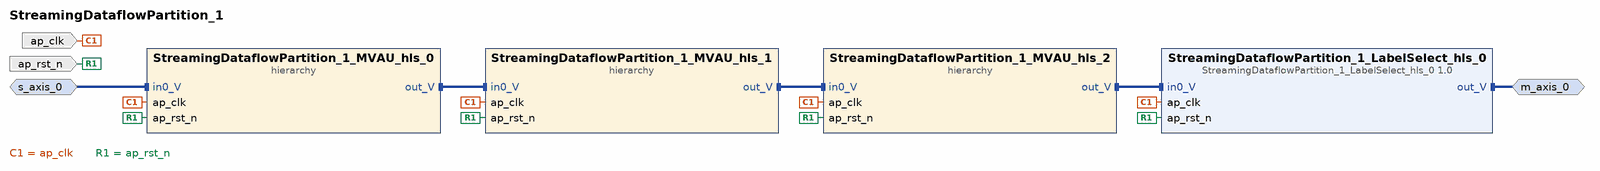
[diagram p0: block diagram of the top level]
# Vivado block design StreamingDataflowPartition_1, xc7z020clg400-1, Vivado 2024.2
create_bd_design StreamingDataflowPartition_1

create_bd_intf_port -mode Slave -vlnv xilinx.com:interface:axis_rtl:1.0 s_axis_0
set_property -dict [list \
  CONFIG.FREQ_HZ 50000000 \
  CONFIG.HAS_TKEEP 0 \
  CONFIG.HAS_TLAST 0 \
  CONFIG.HAS_TREADY 1 \
  CONFIG.HAS_TSTRB 0 \
  CONFIG.LAYERED_METADATA undef \
  CONFIG.TDATA_NUM_BYTES 1 \
  CONFIG.TDEST_WIDTH 0 \
  CONFIG.TID_WIDTH 0 \
  CONFIG.TUSER_WIDTH 0 \
] [get_bd_intf_ports s_axis_0]
create_bd_intf_port -mode Master -vlnv xilinx.com:interface:axis_rtl:1.0 m_axis_0
set_property -dict {CONFIG.FREQ_HZ 50000000} [get_bd_intf_ports m_axis_0]
create_bd_port -dir I -type clk ap_clk
set_property -dict {CONFIG.FREQ_HZ 50000000 CONFIG.FREQ_TOLERANCE_HZ -1} [get_bd_ports ap_clk]
create_bd_port -dir I -type rst ap_rst_n

create_bd_cell -type hier StreamingDataflowPartition_1_MVAU_hls_0
create_bd_cell -type hier StreamingDataflowPartition_1_MVAU_hls_1
create_bd_cell -type hier StreamingDataflowPartition_1_MVAU_hls_2
create_bd_cell -type ip -vlnv xilinx.com:hls:StreamingDataflowPartition_1_LabelSelect_hls_0:1.0 StreamingDataflowPartition_1_LabelSelect_hls_0

# ---- hierarchy /StreamingDataflowPartition_1_MVAU_hls_0 ----
current_bd_instance /StreamingDataflowPartition_1_MVAU_hls_0
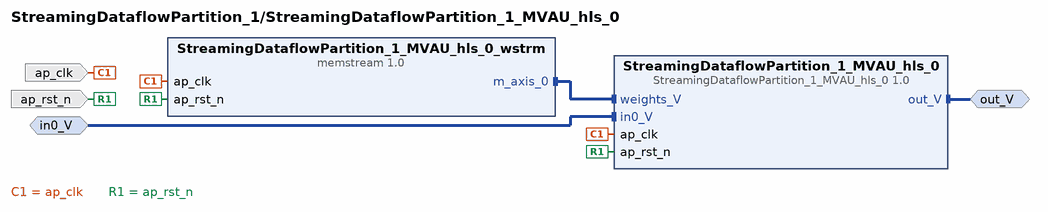
[diagram p1: block diagram inside /StreamingDataflowPartition_1_MVAU_hls_0]
create_bd_intf_pin -mode Master -vlnv xilinx.com:interface:axis_rtl:1.0 out_V
create_bd_intf_pin -mode Slave -vlnv xilinx.com:interface:axis_rtl:1.0 in0_V
create_bd_pin -dir I -type clk ap_clk
create_bd_pin -dir I -type rst ap_rst_n

create_bd_cell -type ip -vlnv xilinx.com:hls:StreamingDataflowPartition_1_MVAU_hls_0:1.0 StreamingDataflowPartition_1_MVAU_hls_0
create_bd_cell -type ip -vlnv amd.com:finn:memstream:1.0 StreamingDataflowPartition_1_MVAU_hls_0_wstrm
set_property -dict [list \
  CONFIG.DEPTH 50176 \
  CONFIG.INIT_FILE /tmp/finn_dev_emre/code_gen_ipgen_StreamingDataflowPartition_1_MVAU_hls_0_vpjpp7ae/memblock.dat \
  CONFIG.RAM_STYLE auto \
  CONFIG.WIDTH 8 \
] [get_bd_cells StreamingDataflowPartition_1_MVAU_hls_0_wstrm]

# ---- hierarchy /StreamingDataflowPartition_1_MVAU_hls_1 ----
current_bd_instance /StreamingDataflowPartition_1_MVAU_hls_1
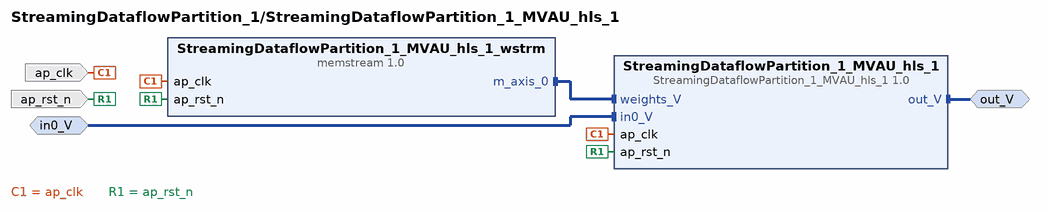
[diagram p2: block diagram inside /StreamingDataflowPartition_1_MVAU_hls_1]
create_bd_intf_pin -mode Master -vlnv xilinx.com:interface:axis_rtl:1.0 out_V
create_bd_intf_pin -mode Slave -vlnv xilinx.com:interface:axis_rtl:1.0 in0_V
create_bd_pin -dir I -type clk ap_clk
create_bd_pin -dir I -type rst ap_rst_n

create_bd_cell -type ip -vlnv xilinx.com:hls:StreamingDataflowPartition_1_MVAU_hls_1:1.0 StreamingDataflowPartition_1_MVAU_hls_1
create_bd_cell -type ip -vlnv amd.com:finn:memstream:1.0 StreamingDataflowPartition_1_MVAU_hls_1_wstrm
set_property -dict [list \
  CONFIG.DEPTH 4096 \
  CONFIG.INIT_FILE /tmp/finn_dev_emre/code_gen_ipgen_StreamingDataflowPartition_1_MVAU_hls_1_2hlhfuts/memblock.dat \
  CONFIG.RAM_STYLE auto \
  CONFIG.WIDTH 8 \
] [get_bd_cells StreamingDataflowPartition_1_MVAU_hls_1_wstrm]

# ---- hierarchy /StreamingDataflowPartition_1_MVAU_hls_2 ----
current_bd_instance /StreamingDataflowPartition_1_MVAU_hls_2
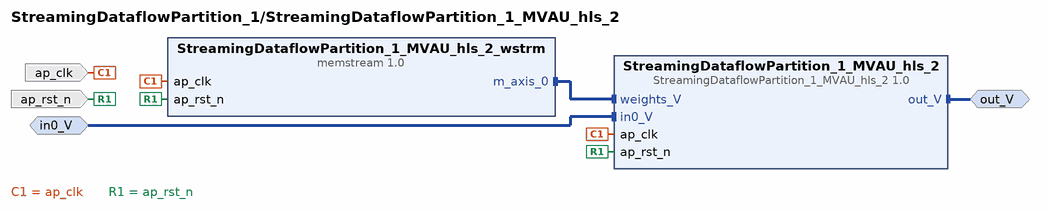
[diagram p3: block diagram inside /StreamingDataflowPartition_1_MVAU_hls_2]
create_bd_intf_pin -mode Master -vlnv xilinx.com:interface:axis_rtl:1.0 out_V
create_bd_intf_pin -mode Slave -vlnv xilinx.com:interface:axis_rtl:1.0 in0_V
create_bd_pin -dir I -type clk ap_clk
create_bd_pin -dir I -type rst ap_rst_n

create_bd_cell -type ip -vlnv xilinx.com:hls:StreamingDataflowPartition_1_MVAU_hls_2:1.0 StreamingDataflowPartition_1_MVAU_hls_2
create_bd_cell -type ip -vlnv amd.com:finn:memstream:1.0 StreamingDataflowPartition_1_MVAU_hls_2_wstrm
set_property -dict [list \
  CONFIG.DEPTH 640 \
  CONFIG.INIT_FILE /tmp/finn_dev_emre/code_gen_ipgen_StreamingDataflowPartition_1_MVAU_hls_2_738qp6bw/memblock.dat \
  CONFIG.RAM_STYLE auto \
  CONFIG.WIDTH 8 \
] [get_bd_cells StreamingDataflowPartition_1_MVAU_hls_2_wstrm]

# ---- connections ----

current_bd_instance /StreamingDataflowPartition_1_MVAU_hls_0
connect_bd_intf_net [get_bd_intf_pins out_V] [get_bd_intf_pins StreamingDataflowPartition_1_MVAU_hls_0/out_V]
connect_bd_intf_net [get_bd_intf_pins StreamingDataflowPartition_1_MVAU_hls_0_wstrm/m_axis_0] [get_bd_intf_pins StreamingDataflowPartition_1_MVAU_hls_0/weights_V]
connect_bd_intf_net [get_bd_intf_pins in0_V] [get_bd_intf_pins StreamingDataflowPartition_1_MVAU_hls_0/in0_V]
connect_bd_net [get_bd_pins ap_clk] \
  [get_bd_pins StreamingDataflowPartition_1_MVAU_hls_0_wstrm/ap_clk] \
  [get_bd_pins StreamingDataflowPartition_1_MVAU_hls_0/ap_clk]
connect_bd_net [get_bd_pins ap_rst_n] \
  [get_bd_pins StreamingDataflowPartition_1_MVAU_hls_0_wstrm/ap_rst_n] \
  [get_bd_pins StreamingDataflowPartition_1_MVAU_hls_0/ap_rst_n]

current_bd_instance /StreamingDataflowPartition_1_MVAU_hls_1
connect_bd_intf_net [get_bd_intf_pins out_V] [get_bd_intf_pins StreamingDataflowPartition_1_MVAU_hls_1/out_V]
connect_bd_intf_net [get_bd_intf_pins StreamingDataflowPartition_1_MVAU_hls_1_wstrm/m_axis_0] [get_bd_intf_pins StreamingDataflowPartition_1_MVAU_hls_1/weights_V]
connect_bd_intf_net [get_bd_intf_pins in0_V] [get_bd_intf_pins StreamingDataflowPartition_1_MVAU_hls_1/in0_V]
connect_bd_net [get_bd_pins ap_clk] \
  [get_bd_pins StreamingDataflowPartition_1_MVAU_hls_1_wstrm/ap_clk] \
  [get_bd_pins StreamingDataflowPartition_1_MVAU_hls_1/ap_clk]
connect_bd_net [get_bd_pins ap_rst_n] \
  [get_bd_pins StreamingDataflowPartition_1_MVAU_hls_1_wstrm/ap_rst_n] \
  [get_bd_pins StreamingDataflowPartition_1_MVAU_hls_1/ap_rst_n]

current_bd_instance /StreamingDataflowPartition_1_MVAU_hls_2
connect_bd_intf_net [get_bd_intf_pins out_V] [get_bd_intf_pins StreamingDataflowPartition_1_MVAU_hls_2/out_V]
connect_bd_intf_net [get_bd_intf_pins StreamingDataflowPartition_1_MVAU_hls_2_wstrm/m_axis_0] [get_bd_intf_pins StreamingDataflowPartition_1_MVAU_hls_2/weights_V]
connect_bd_intf_net [get_bd_intf_pins in0_V] [get_bd_intf_pins StreamingDataflowPartition_1_MVAU_hls_2/in0_V]
connect_bd_net [get_bd_pins ap_clk] \
  [get_bd_pins StreamingDataflowPartition_1_MVAU_hls_2_wstrm/ap_clk] \
  [get_bd_pins StreamingDataflowPartition_1_MVAU_hls_2/ap_clk]
connect_bd_net [get_bd_pins ap_rst_n] \
  [get_bd_pins StreamingDataflowPartition_1_MVAU_hls_2_wstrm/ap_rst_n] \
  [get_bd_pins StreamingDataflowPartition_1_MVAU_hls_2/ap_rst_n]

current_bd_instance /
connect_bd_intf_net [get_bd_intf_ports m_axis_0] [get_bd_intf_pins StreamingDataflowPartition_1_LabelSelect_hls_0/out_V]
connect_bd_intf_net [get_bd_intf_pins StreamingDataflowPartition_1_MVAU_hls_0/out_V] [get_bd_intf_pins StreamingDataflowPartition_1_MVAU_hls_1/in0_V]
connect_bd_intf_net [get_bd_intf_pins StreamingDataflowPartition_1_MVAU_hls_1/out_V] [get_bd_intf_pins StreamingDataflowPartition_1_MVAU_hls_2/in0_V]
connect_bd_intf_net [get_bd_intf_pins StreamingDataflowPartition_1_MVAU_hls_2/out_V] [get_bd_intf_pins StreamingDataflowPartition_1_LabelSelect_hls_0/in0_V]
connect_bd_intf_net -intf_net in0_V_0_1 [get_bd_intf_ports s_axis_0] [get_bd_intf_pins StreamingDataflowPartition_1_MVAU_hls_0/in0_V]
connect_bd_net -net ap_clk_0_1 [get_bd_ports ap_clk] \
  [get_bd_pins StreamingDataflowPartition_1_MVAU_hls_0/ap_clk] [get_bd_pins StreamingDataflowPartition_1_MVAU_hls_1/ap_clk] \
  [get_bd_pins StreamingDataflowPartition_1_MVAU_hls_2/ap_clk] \
  [get_bd_pins StreamingDataflowPartition_1_LabelSelect_hls_0/ap_clk]
connect_bd_net -net ap_rst_n_0_1 [get_bd_ports ap_rst_n] \
  [get_bd_pins StreamingDataflowPartition_1_MVAU_hls_0/ap_rst_n] \
  [get_bd_pins StreamingDataflowPartition_1_MVAU_hls_1/ap_rst_n] \
  [get_bd_pins StreamingDataflowPartition_1_MVAU_hls_2/ap_rst_n] \
  [get_bd_pins StreamingDataflowPartition_1_LabelSelect_hls_0/ap_rst_n]

validate_bd_design
save_bd_design
